# EAGLE design D1MPOWER (EAGLE 8.6.0)
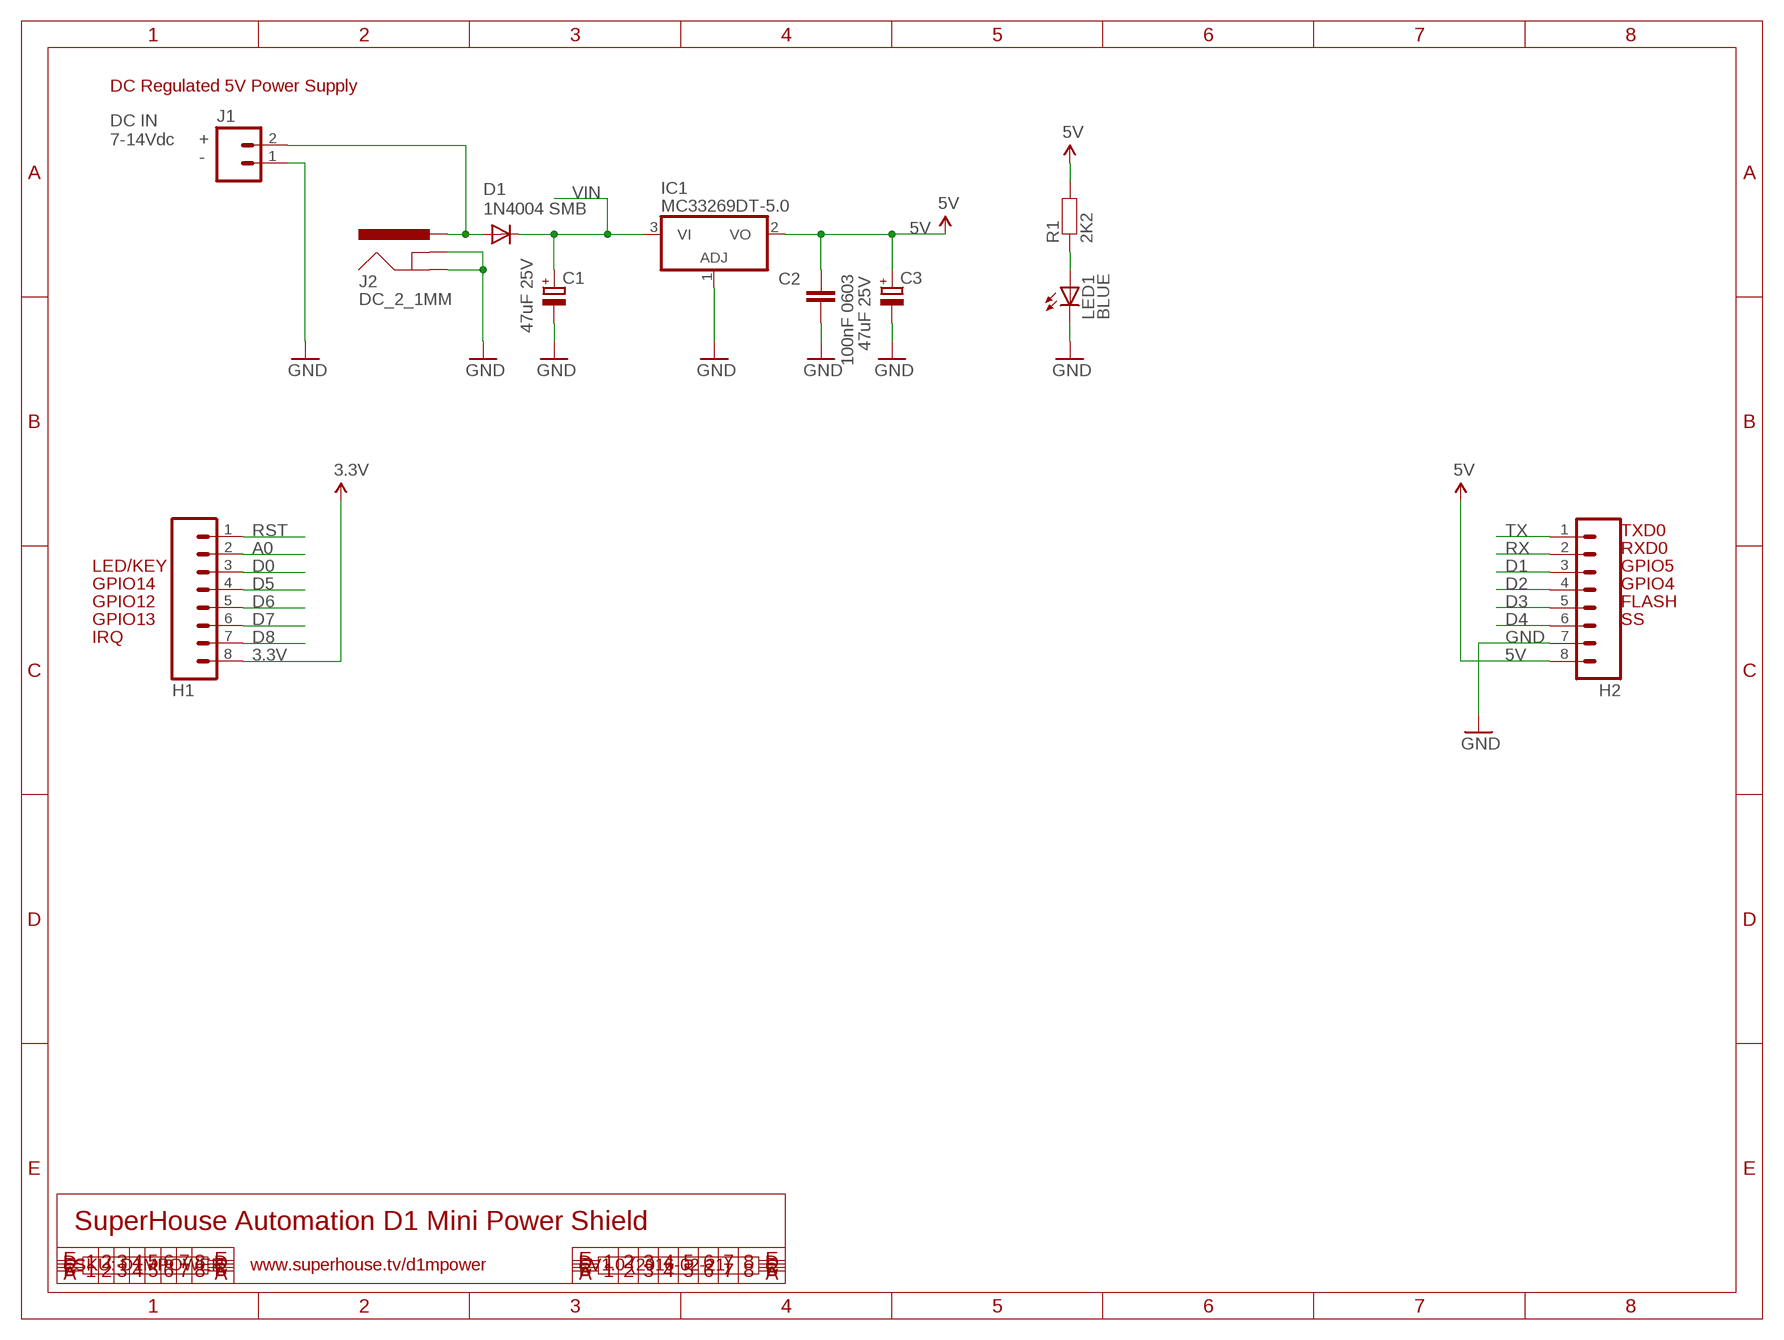
[diagram p0: schematic, sheet 1]

## Parts
C1  47uF 25V  CPOL-EUD  [PANASONIC_D]
C2  100nF 0603  CAP0603  [0603]
C3  47uF 25V  CPOL-EUD  [PANASONIC_D]
D1  1N4004 SMB  DIODESMB  [SMB-DIODE]
H1  M08  [1X08]
H2  M08  [1X08]
IC1  MC33269DT-5.0  MC33269D-5.0  [DPACK]
J1  M023.5MM  [SCREWTERMINAL-3.5MM-2]
J2  DC_2_1MM  POWER_JACKPTH  [POWER_JACK_PTH]
LED1  BLUE  LED0603  [LED-0603]
R1  2K2  RESISTOR0603  [0603]

## Nets
3.3V: H1.8
5V: C2.1 C3.+ H2.8 IC1.2(VO) R1.2
A0: H1.2
D0: H1.3
D1: H2.3
D2: H2.4
D3: H2.5
D4: H2.6
D5: H1.4
D6: H1.5
D7: H1.6
D8: H1.7
GND: C1.- C2.2 C3.- H2.7 IC1.1(ADJ) J1.1 J2.GND J2.GNDBREAK LED1.C
N$1: LED1.A R1.1
N$8: D1.A J1.2 J2.PWR
RST: H1.1
RX: H2.2
TX: H2.1
VIN: C1.+ D1.C IC1.3(VI)

## Notes on the sheet
- DC Regulated 5V Power Supply
- DC IN
  7-14Vdc
- +
- -
- TXD0
- RXD0
- LED/KEY | GPIO5
- GPIO14 | GPIO4
- GPIO12 | FLASH
- GPIO13 | SS
- IRQ
- SuperHouse Automation D1 Mini Power Shield
- SKU: D1MPOWER | www.superhouse.tv/d1mpower | V1.0 (2016-02-21)

## Library data of the parts
C1 C3 = rcl:CPOL-EU: POLARIZED CAPACITOR, European symbol
C2 = freetronics:CAP: Capacitor Standard 0603 ceramic capacitor, and 0.1" leaded capacitor.
D1 = freetronics:DIODE: Diode These are standard reverse protection diodes and small signal diodes. SMA package can handle up to about 1A. SOD-323 can handle about 200mA. What the SOD-323 package when ordering, there are some mfgs out there that are 5-pin packages.
H1 H2 = freetronics-original:M08: Header 8 Standard 8-pin 0.1" header. Use with straight break away headers (SKU : PRT-00116), right angle break away headers (PRT-00553), swiss pins (PRT-00743), machine pins (PRT-00117), and female headers (PRT-00115).
IC1 = linear:MC33269?*: Adjustable Output Low Dropout Voltage Regulator 800 mA Source: http://www.onsemi.com/pub/Collateral/MC33269-D.PDF
J1 = freetronics-jon:M02: Header 2 Standard 2-pin 0.1" header. Use with straight break away headers (SKU : PRT-00116), right angle break away headers (PRT-00553), swiss pins (PRT-00743), machine pins (PRT-00117), and female headers (PRT-00115). Molex polarized connector foot print use with SKU : PRT-08233 with associated crimp pins and housings.
J2 = freetronics:POWER_JACK: Power Jack This is the standard 5.5mm barrel jack for power. The PTH is the most common, proven, reliable, footprint. All others are experimental. The Slot footprint only works if the mill layer is transmitted to the PCB fab house so be warned. Spark Fun Electronics SKU : PRT-00119. Mating wall wart : TOL-00298 (and others)
LED1 = freetronics-jon:LED: LEDs Standard schematic elements and footprints for 5mm, 3mm, 1206, and 0603 sized LEDs. 5mm - Spark Fun Electronics SKU : COM-00529 (and others)
R1 = freetronics-jon:RESISTOR: Resistor Basic schematic elements and footprints for 0603, 1206, and PTH 1/10th watt (small) resistors.

## Net classes
0 default: width 0.203 mm, drill 0.356 mm, clearance 0.152 mm
1 power: width 0.203 mm, clearance 0.152 mm

## Board
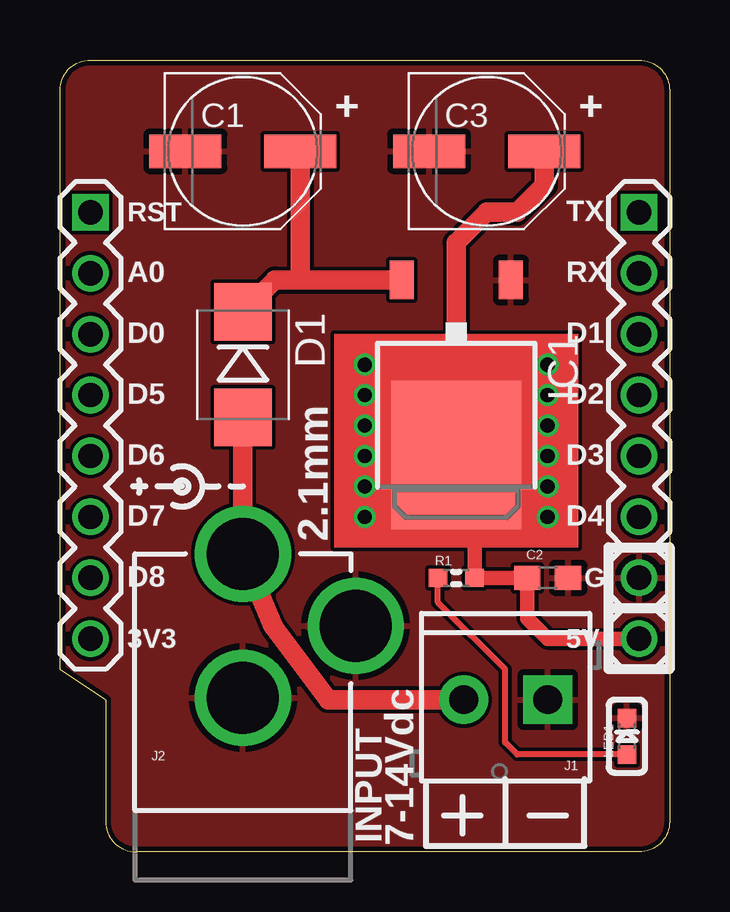
[diagram p1: board, top side]
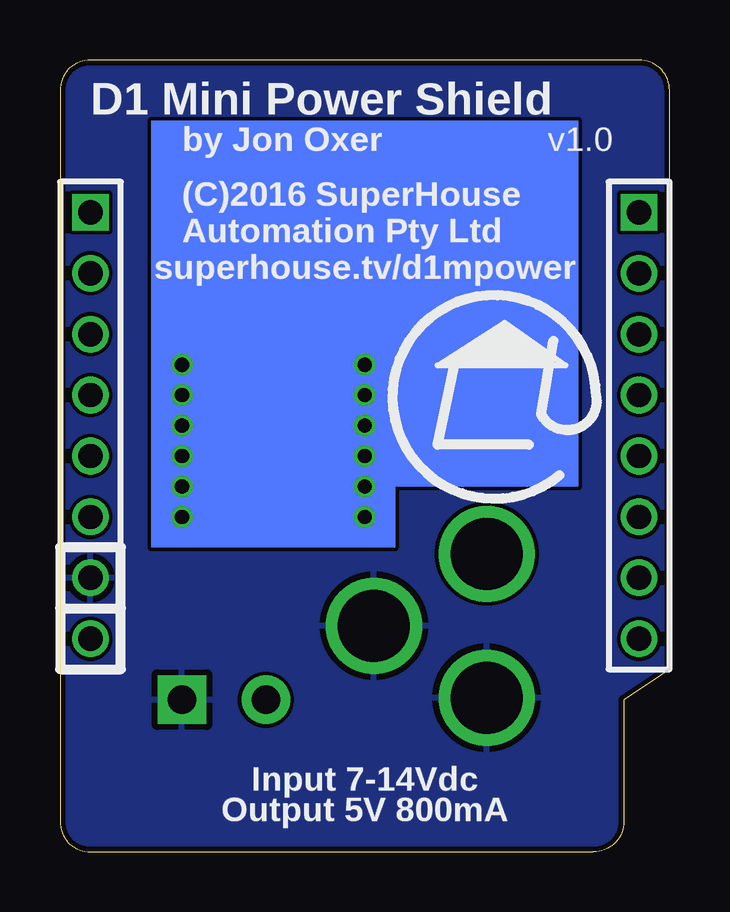
[diagram p2: board, bottom side, seen from below]

Size 25.4 x 33.02 mm. Coordinates in mm from the lower left corner, seen from the top.
Outline: 25.4,31.75 25.4,1.27 arc-90 24.13,0 3.17,0 arc-90 1.91,1.27 1.91,6.35 0,7.62 0,31.75 arc-90 1.27,33.02 24.13,33.02 arc-90 25.4,31.75
Copper layers (1*16): Top 0.035mm / dielectric 1.5mm / Bottom 0.035mm
Design rules "ElectroDragon_2layer_DRU_no_angle_20140221": minimum track width 6mil, minimum drill 12mil, track to track 6mil, track to pad 6mil, pad to pad 6mil, via to via 6mil, smd to smd 6mil, copper to edge 8mil, drill to drill 6mil, minimum pad ring 10mil, minimum via ring 6mil, stop-mask expansion 4mil, vias tented up to drill 100mil, thermal gap 10mil

### Footprints (pad centres in the part's own frame; a part is rotated, then mirrored left to right if it is on the bottom)
PANASONIC_D = smd 3 x 1.4: + 2.4,0; - -2.4,0
0603 = smd 1.1 x 1: 1 -0.85,0; 2 0.85,0
SMB-DIODE = smd 2.4 x 2.4: A 2.2,0; C -2.2,0
1X08 = drill 1.016 square: 1 0,0 | drill 1.016: 2 2.54,0; 3 5.08,0; 4 7.62,0; 5 10.16,0; 6 12.7,0; 7 15.24,0; 8 17.78,0
DPACK = smd 1 x 1.6: 1 -2.28,-4.8; 3 2.28,-4.8 | smd 5.4 x 6.2: 2 0,2.5
SCREWTERMINAL-3.5MM-2 = drill 1.2 pad 2.032 square: 1 0,0 | drill 1.2 pad 2.032: 2 3.5,0
POWER_JACK_PTH = drill 2.997: GND 0,7.7; GNDBREAK 4.7,10.7; PWR 0,13.7
LED-0603 = smd 0.762 x 0.762: A -0.762,0; C 0.762,0
0603' = smd 0.762 x 0.762: 1 -0.762,0; 2 0.762,0

### Placement (x,y rotation side)
C1  7.62,29.21 0 top
C2  20.32,11.43 0 top
C3  17.78,29.21 0 top
D1  7.62,20.32 270 top
H1  1.27,26.67 270 top
H2  24.13,26.67 270 top
IC1  16.51,19.05 180 top
J1  20.32,6.35 180 top
J2  7.62,-1.27 0 top
LED1  23.62,4.83 90 top
R1  2K2  [0603']  16.51,11.43 0 top

### Tracks (layer width: path | path; a pad name or v marks a point on that pad's centre or on a via)
5V  (via drill 0.6)
  Top 0.254: v12.7,20.32 v12.7,19.05 v12.7,17.78 v12.7,16.51 | v12.7,16.51 v12.7,15.24 v12.7,13.97 | v12.7,16.51 16.47,16.51 IC1.2 16.55,16.51 v20.32,16.51 | v20.32,20.32 v20.32,19.05 v20.32,17.78 v20.32,16.51 | v20.32,16.51 v20.32,15.24 v20.32,13.97
  Top 0.61: IC1.2 17.27,15.79 R1.2 C2.1 19.47,9.74 20.32,8.89 H2.8
  Top 0.813: C3.+ 20.18,27.8 19.05,26.67 17.78,26.67 16.51,25.4 IC1.2
GND
  pour Top: 25.4,31.75 arc90 24.13,33.02 1.27,33.02 arc90 0,31.75 0,7.62 1.91,6.35 1.91,1.27 arc90 3.17,0 24.13,0 arc90 25.4,1.27
  pour Bottom: 25.4,1.27 25.4,31.75 arc90 24.13,33.02 1.27,33.02 arc90 0,31.75 0,7.62 1.91,6.35 1.91,1.27 arc90 3.17,0 24.13,0 arc90
N$1
  Top 0.254: LED1.A 19.05,4.06 18.54,4.57 18.54,7.62 15.75,10.41 R1.1
N$8
  Top 0.813: J1.2 11.18,6.35 8.89,9.4 J2.PWR D1.A
VIN
  Top 0.813: D1.C 8.95,23.85 10.16,23.85 | 10.16,23.85 IC1.3 | C1.+ 10.02,23.99 10.16,23.85
(copper drawn outside any net)
  shapes: Bottom area x2, Top area x1

### Text on the board
tPlace: + | + | 2.1mm | INPUT | 7-14Vdc
bPlace: D1 Mini Power Shield | v1.0 | by Jon Oxer | (C)2016 SuperHouse / Automation Pty Ltd | superhouse.tv/d1mpower | Input 7-14Vdc | Output 5V 800mA
tNames: RST | TX | A0 | RX | D0 | D1 | D5 | D2 | D6 | D3 | D7 | D4 | D8 | G | 3V3 | 5V
tDocu: C | A | C | A